# EAGLE schematic testing_jig (EAGLE 9.7.0)
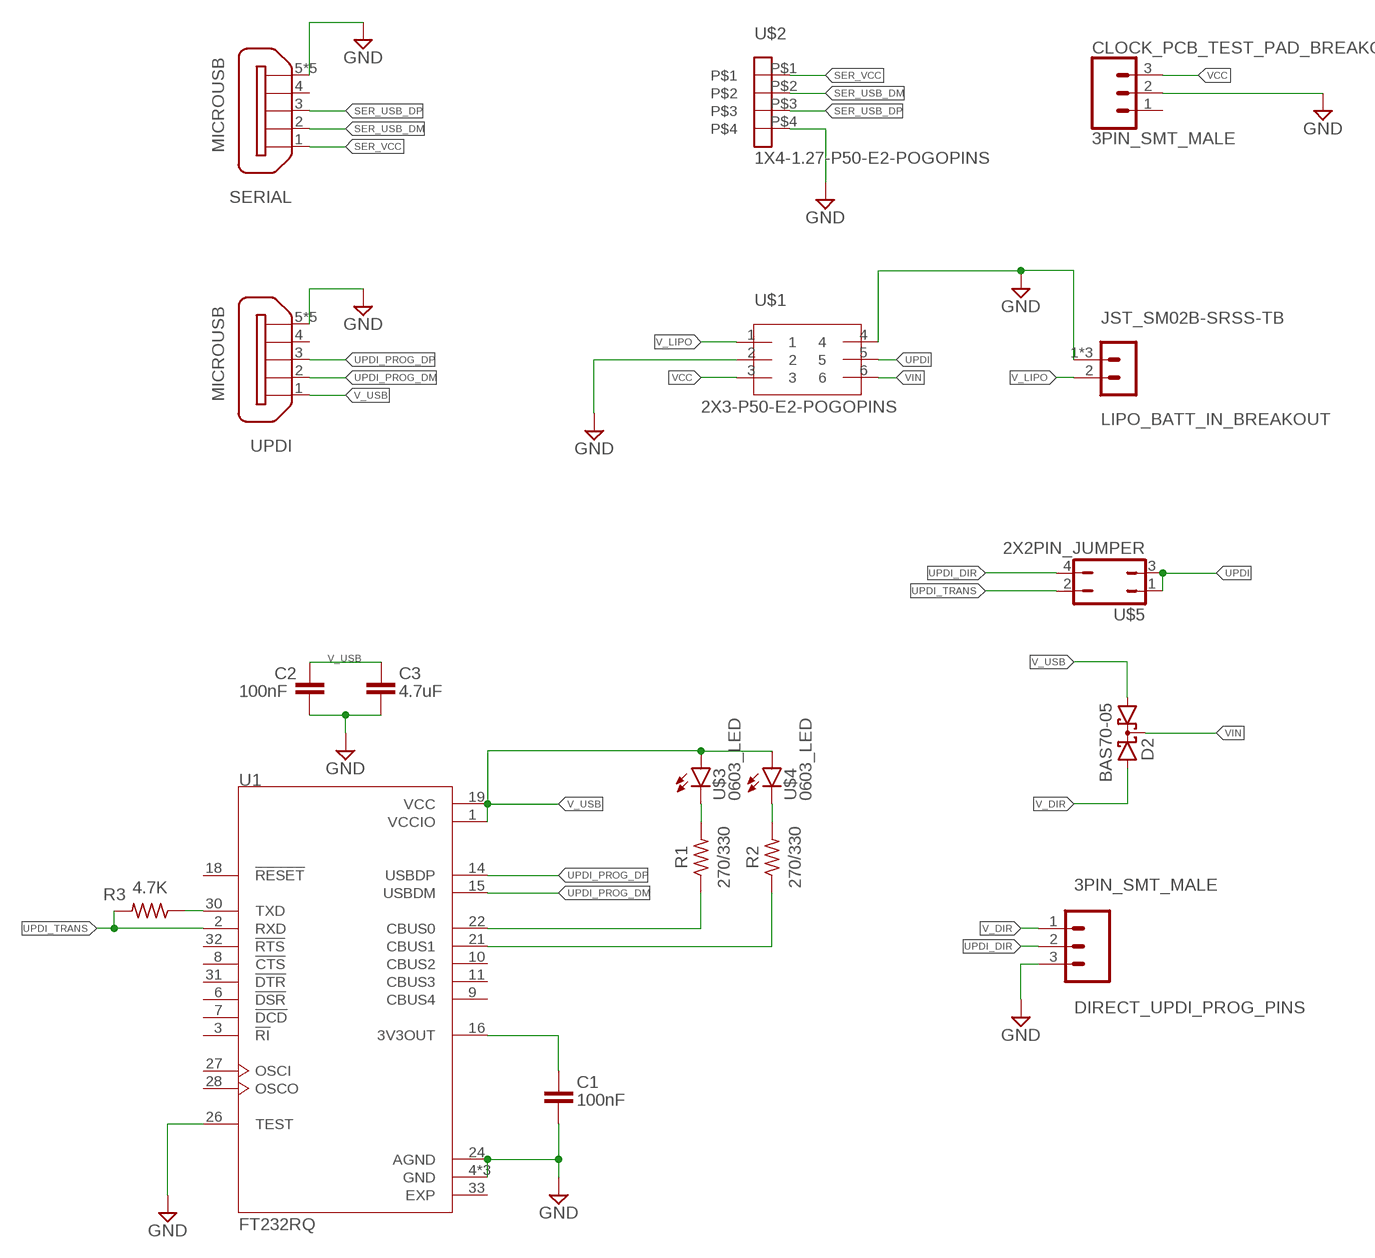
[diagram p0: schematic, sheet 1, part 1 of 2]
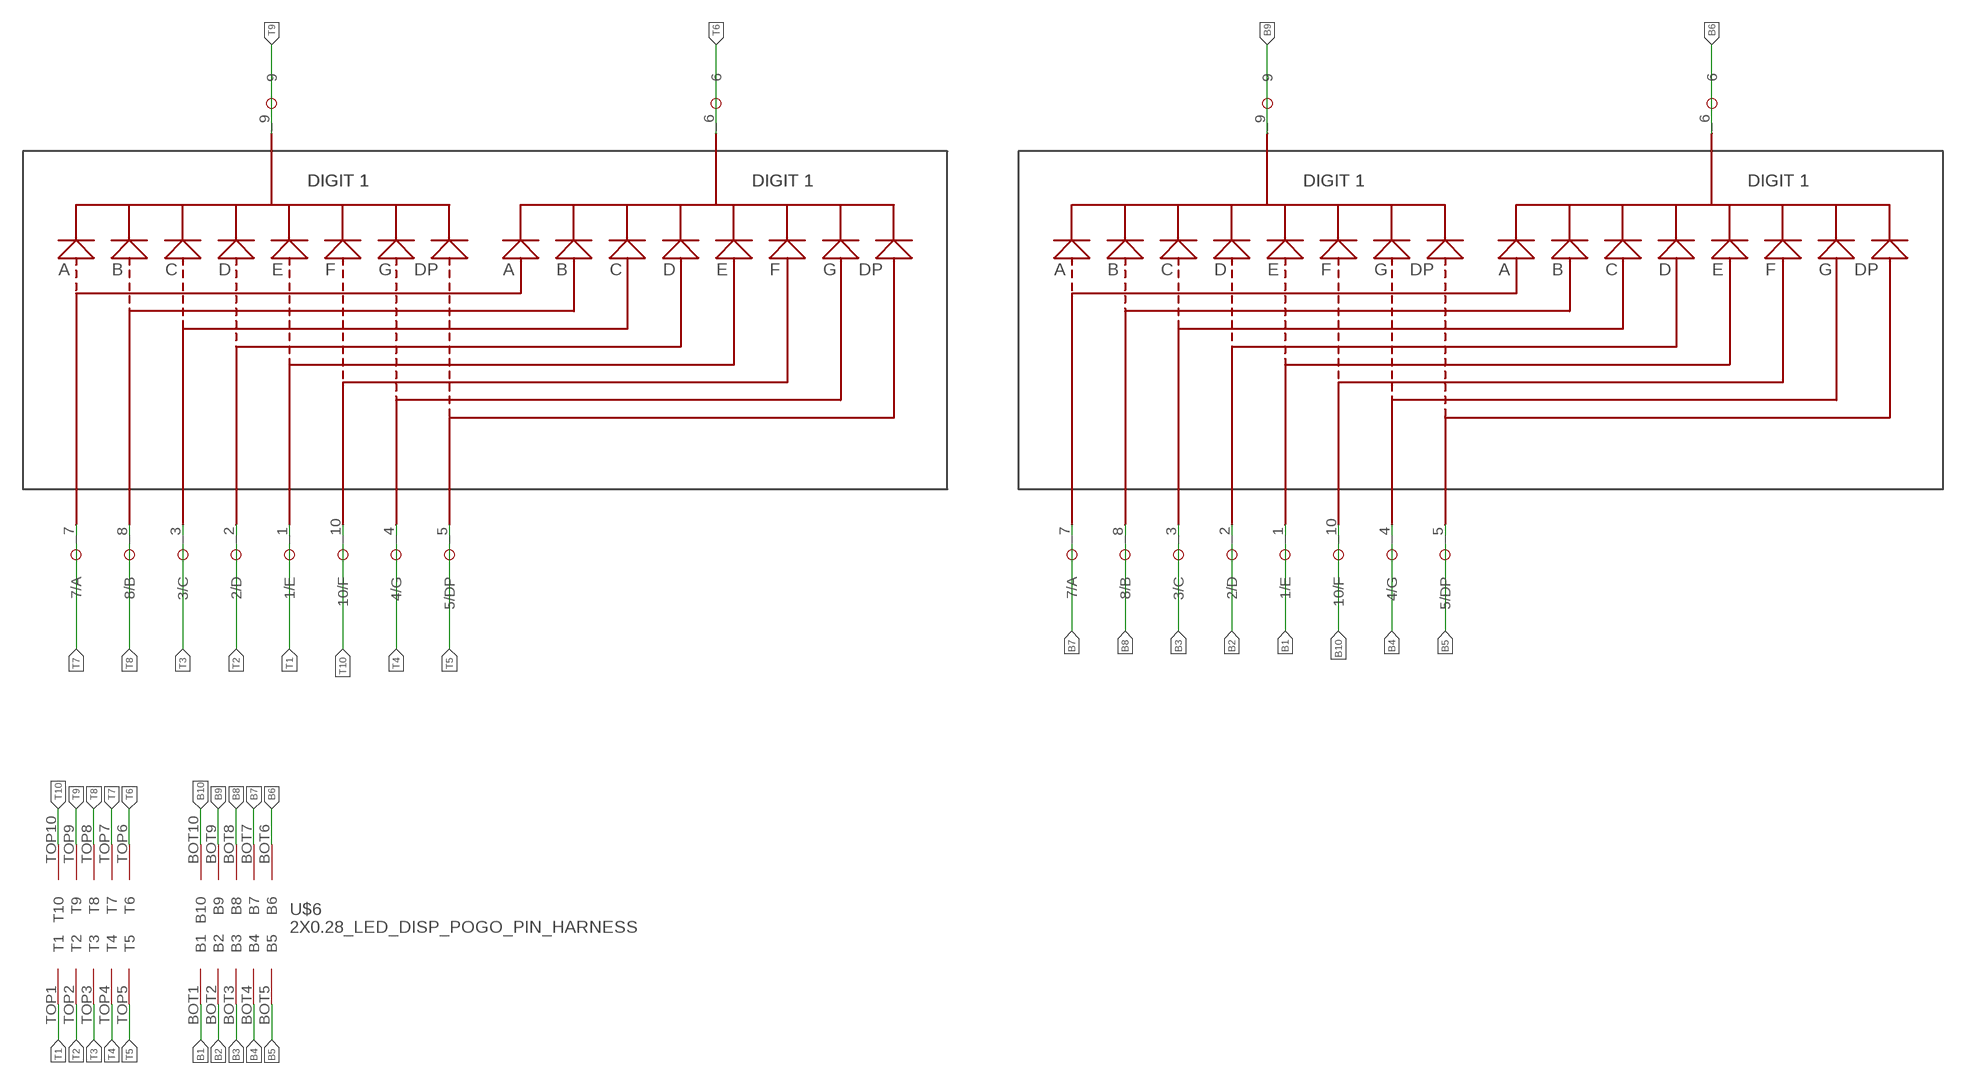
[diagram p1: schematic, sheet 1, part 2 of 2]

## Parts
BOTTOM  0.28"-2DIGIT-7SEGEMNT  [2_DIGIT_0.28"]
C1  100nF  0603CAP  [0603CAP]
C2  100nF  0603CAP  [0603CAP]
C3  4.7uF  0603CAP  [0603CAP]
CLOCK_PCB_TEST_PAD_BREAKOUT  3PIN_SMT_MALE  [3PIN__SMT_MALE]
D2  BAS70-05  [SOT23]
DIRECT_UPDI_PROG_PINS  3PIN_SMT_MALE  [3PIN__SMT_MALE]
LIPO_BATT_IN_BREAKOUT  JST_SM02B-SRSS-TB  [JST-SM02B-SRSS-TB]
R1  270/330  R-US_CHIP-0603(1608-METRIC)  [RESC1608X60]
R2  270/330  R-US_CHIP-0603(1608-METRIC)  [RESC1608X60]
R3  4.7K  R-US_CHIP-0603(1608-METRIC)  [RESC1608X60]
SERIAL  MICROUSB  [ZX62D-B-5PA8]
TOP  0.28"-2DIGIT-7SEGEMNT  [2_DIGIT_0.28"]
U1  FT232RQ  [QFN50P500X500X90-33N]
U$1  2X3-P50-E2-POGOPINS  [2X3-P50-E2-POGOPINS]
U$2  1X4-1.27-P50-E2-POGOPINS  [1X4-1.27-P50-E2-POGOPINS]
U$3  0603_LED  [0603_LED]
U$4  0603_LED  [0603_LED]
U$5  2X2PIN_JUMPER  [2X2PIN_JUMPER]
U$6  2X0.28_LED_DISP_POGO_PIN_HARNESS  [2X0.28_LED_DISP_POGO_PIN_HARNESS]
UPDI  MICROUSB  [ZX62D-B-5PA8]

## Nets
3V3OUT: C1.1 U1.16(3V3OUT)
B1: BOTTOM._1(1/E) U$6.BOT1(B1)
B2: BOTTOM._2(2/D) U$6.BOT2(B2)
B3: BOTTOM._3(3/C) U$6.BOT3(B3)
B4: BOTTOM._4(4/G) U$6.BOT4(B4)
B5: BOTTOM._5(5/DP) U$6.BOT5(B5)
B6: BOTTOM._6 U$6.BOT6(B6)
B7: BOTTOM._7(7/A) U$6.BOT7(B7)
B8: BOTTOM._8(8/B) U$6.BOT8(B8)
B9: BOTTOM._9 U$6.BOT9(B9)
B10: BOTTOM._10(10/F) U$6.BOT10(B10)
CBUS0: R1.1 U1.22(CBUS0)
CBUS1: R2.1 U1.21(CBUS1)
GND: C1.2 C2.2 C3.2 CLOCK_PCB_TEST_PAD_BREAKOUT.2 DIRECT_UPDI_PROG_PINS.3 LIPO_BATT_IN_BREAKOUT.1 LIPO_BATT_IN_BREAKOUT.M1 LIPO_BATT_IN_BREAKOUT.M2 SERIAL.5 SERIAL.S1 SERIAL.S2 SERIAL.S3 SERIAL.S4 U1.4(GND) U1.17(GND) U1.20(GND) U1.24(AGND) U1.26(TEST) U$1.2 U$1.4 U$2.P$4 UPDI.5 UPDI.S1 UPDI.S2 UPDI.S3 UPDI.S4
N$1: R1.2 U$3.C
N$2: R2.2 U$4.C
SER_USB_DM: SERIAL.2 U$2.P$2
SER_USB_DP: SERIAL.3 U$2.P$3
SER_VCC: SERIAL.1 U$2.P$1
T1: TOP._1(1/E) U$6.TOP1(T1)
T2: TOP._2(2/D) U$6.TOP2(T2)
T3: TOP._3(3/C) U$6.TOP3(T3)
T4: TOP._4(4/G) U$6.TOP4(T4)
T5: TOP._5(5/DP) U$6.TOP5(T5)
T6: TOP._6 U$6.TOP6(T6)
T7: TOP._7(7/A) U$6.TOP7(T7)
T8: TOP._8(8/B) U$6.TOP8(T8)
T9: TOP._9 U$6.TOP9(T9)
T10: TOP._10(10/F) U$6.TOP10(T10)
TXD: R3.1 U1.30(TXD)
UPDI: U$1.5 U$5.1 U$5.3
UPDI_DIR: DIRECT_UPDI_PROG_PINS.2 U$5.4
UPDI_PROG_DM: U1.15(USBDM) UPDI.2
UPDI_PROG_DP: U1.14(USBDP) UPDI.3
UPDI_TRANS: R3.2 U1.2(RXD) U$5.2
V_DIR: D2.2(A2) DIRECT_UPDI_PROG_PINS.1
V_LIPO: LIPO_BATT_IN_BREAKOUT.2 U$1.1
V_USB: C2.1 C3.1 D2.1(A1) U1.1(VCCIO) U1.19(VCC) U$3.A U$4.A UPDI.1
VCC: CLOCK_PCB_TEST_PAD_BREAKOUT.3 U$1.3
VIN: D2.3(C) U$1.6
Unconnected: CLOCK_PCB_TEST_PAD_BREAKOUT.1 SERIAL.4 U1.3(!RI) U1.6(!DSR) U1.7(!DCD) U1.8(!CTS) U1.9(CBUS4) U1.10(CBUS2) U1.11(CBUS3) U1.18(!RESET) U1.27(OSCI) U1.28(OSCO) U1.31(!DTR) U1.32(!RTS) UPDI.4

## Power pins joined to a net without a drawn wire
EXP: U1.33(EXP)

## Library data of the parts
BOTTOM TOP = MY_CLOCK_LIB_COMPONENTS:0.28"-2DIGIT-7SEGEMNT
C1-C3 = MY_CLOCK_LIB_COMPONENTS:0603CAP
CLOCK_PCB_TEST_PAD_BREAKOUT DIRECT_UPDI_PROG_PINS = keyboard_lib:3PIN_SMT_MALE
D2 = BAS_40_05:BAS70-05: Silicon Schottky Diodes General-purpose diode for high-speed switching
LIPO_BATT_IN_BREAKOUT = MY_CLOCK_LIB_COMPONENTS:JST_SM02B-SRSS-TB
R1-R3 = MY_0603_RES:R-US: Resistor Fixed - ANSI; CATEGORY: Resistor; SUB-CATEGORY: Fixed
SERIAL UPDI = MY_CLOCK_LIB_COMPONENTS:MICROUSB
U1 = FT232RQ:FT232RQ: USB-to-UART 1-CH 256Byte FIFO 5V 32-Pin QFN EP; A_MAX: 0.9; B_MAX: 0.3; B_MIN: 0.2; B_NOM: 0.25; D2_NOM: 3.4; D_MAX: 5.0; D_MIN: 5.0; D_NOM: 5.0; E2_NOM: 3.4; ENOM: 0.5; E_MAX: 5.0; E_MIN: 5.0; E_NOM: 5.0; L_MAX: 0.45; L_MIN: 0.35; L_NOM: 0.4; MANUFACTURER: FTDI; MAXIMUM_PACKAGE_HEIGHT: 0.9mm; PARTREV: 2.15; PIN_COUNT_D: 8.0; PIN_COUNT_E: 8.0; SNAPEDA_PACKAGE_ID: 71296; STANDARD: IPC 7351B
U$1 = MY_CLOCK_LIB_COMPONENTS:2X3-P50-E2-POGOPINS
U$2 = MY_CLOCK_LIB_COMPONENTS:1X4-1.27-P50-E2-POGOPINS
U$3 U$4 = MY_CLOCK_LIB_COMPONENTS:0603_LED
U$5 = MY_CLOCK_LIB_COMPONENTS:2X2PIN_JUMPER
U$6 = MY_CLOCK_LIB_COMPONENTS:2X0.28_LED_DISP_POGO_PIN_HARNESS